# Altium schematic sheet 08-THREAD.SchDoc
size A4
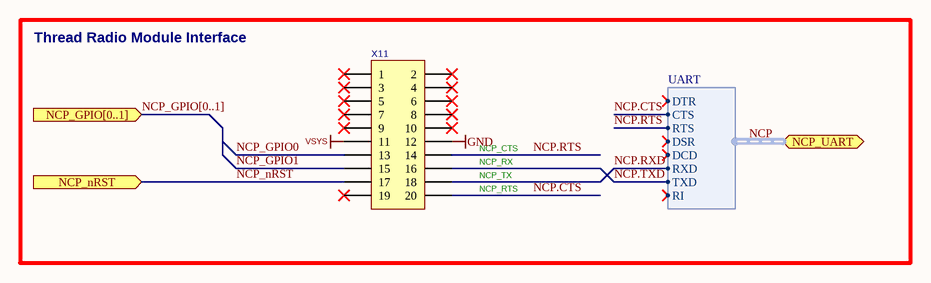
[diagram p0: 08-THREAD.SchDoc]

## Parts
X11  PH2-20-UA  [T_JVE_21B22564-40S10B-01G - ThreadModule]  (value not drawn)

## Blocks framed on the sheet
Thread Radio Module Interface: X11

## Ports
NCP_GPIO[0..1] (in), NCP_nRST (in), NCP_UART (bidir, harness UART)

## Harnesses
UART: RTS, DSR, DCD, RXD, TXD, CTS, DTR, RI

## Nets
GND: X11.12
VSYS: X11.11
NCP.CTS: X11.20 ; port NCP_UART.CTS
NCP.RTS: X11.14 ; port NCP_UART.RTS
NCP.RXD: X11.18 ; port NCP_UART.RXD
NCP.TXD: X11.16 ; port NCP_UART.TXD
NCP_GPIO0: X11.13
NCP_GPIO1: X11.15
NCP_nRST: X11.17 ; port NCP_nRST

Not connected (* = marked no-connect by the designer): X11 1* 2* 3* 4* 5* 6* 7* 8* 9* 10* 19*

## Buses and harness runs
bus NCP_GPIO[0..1] = port NCP_GPIO[0..1]
harness NCP = port NCP_UART

## Notes on the sheet
- NCP_RX
- NCP_CTS
- NCP_TX
- NCP_RTS

## Library data of the parts
X11 = CON-Adam-PH2-20-UA-2X10-2.54mm_ThreadModule: Connector Header Through Hole 20 position 0.100" (2.54mm); No. of ways: 2X20; MFG: FCI; MFG_PN: 68691-420HLF; Supplier 1: Digi-Key; Supplier Part Number 1: 2057-PH2-20-UA-ND; System: Connector; Footprint Checked: -; Symbol Checked: -